# EAGLE schematic MD (EAGLE 9.6.2)
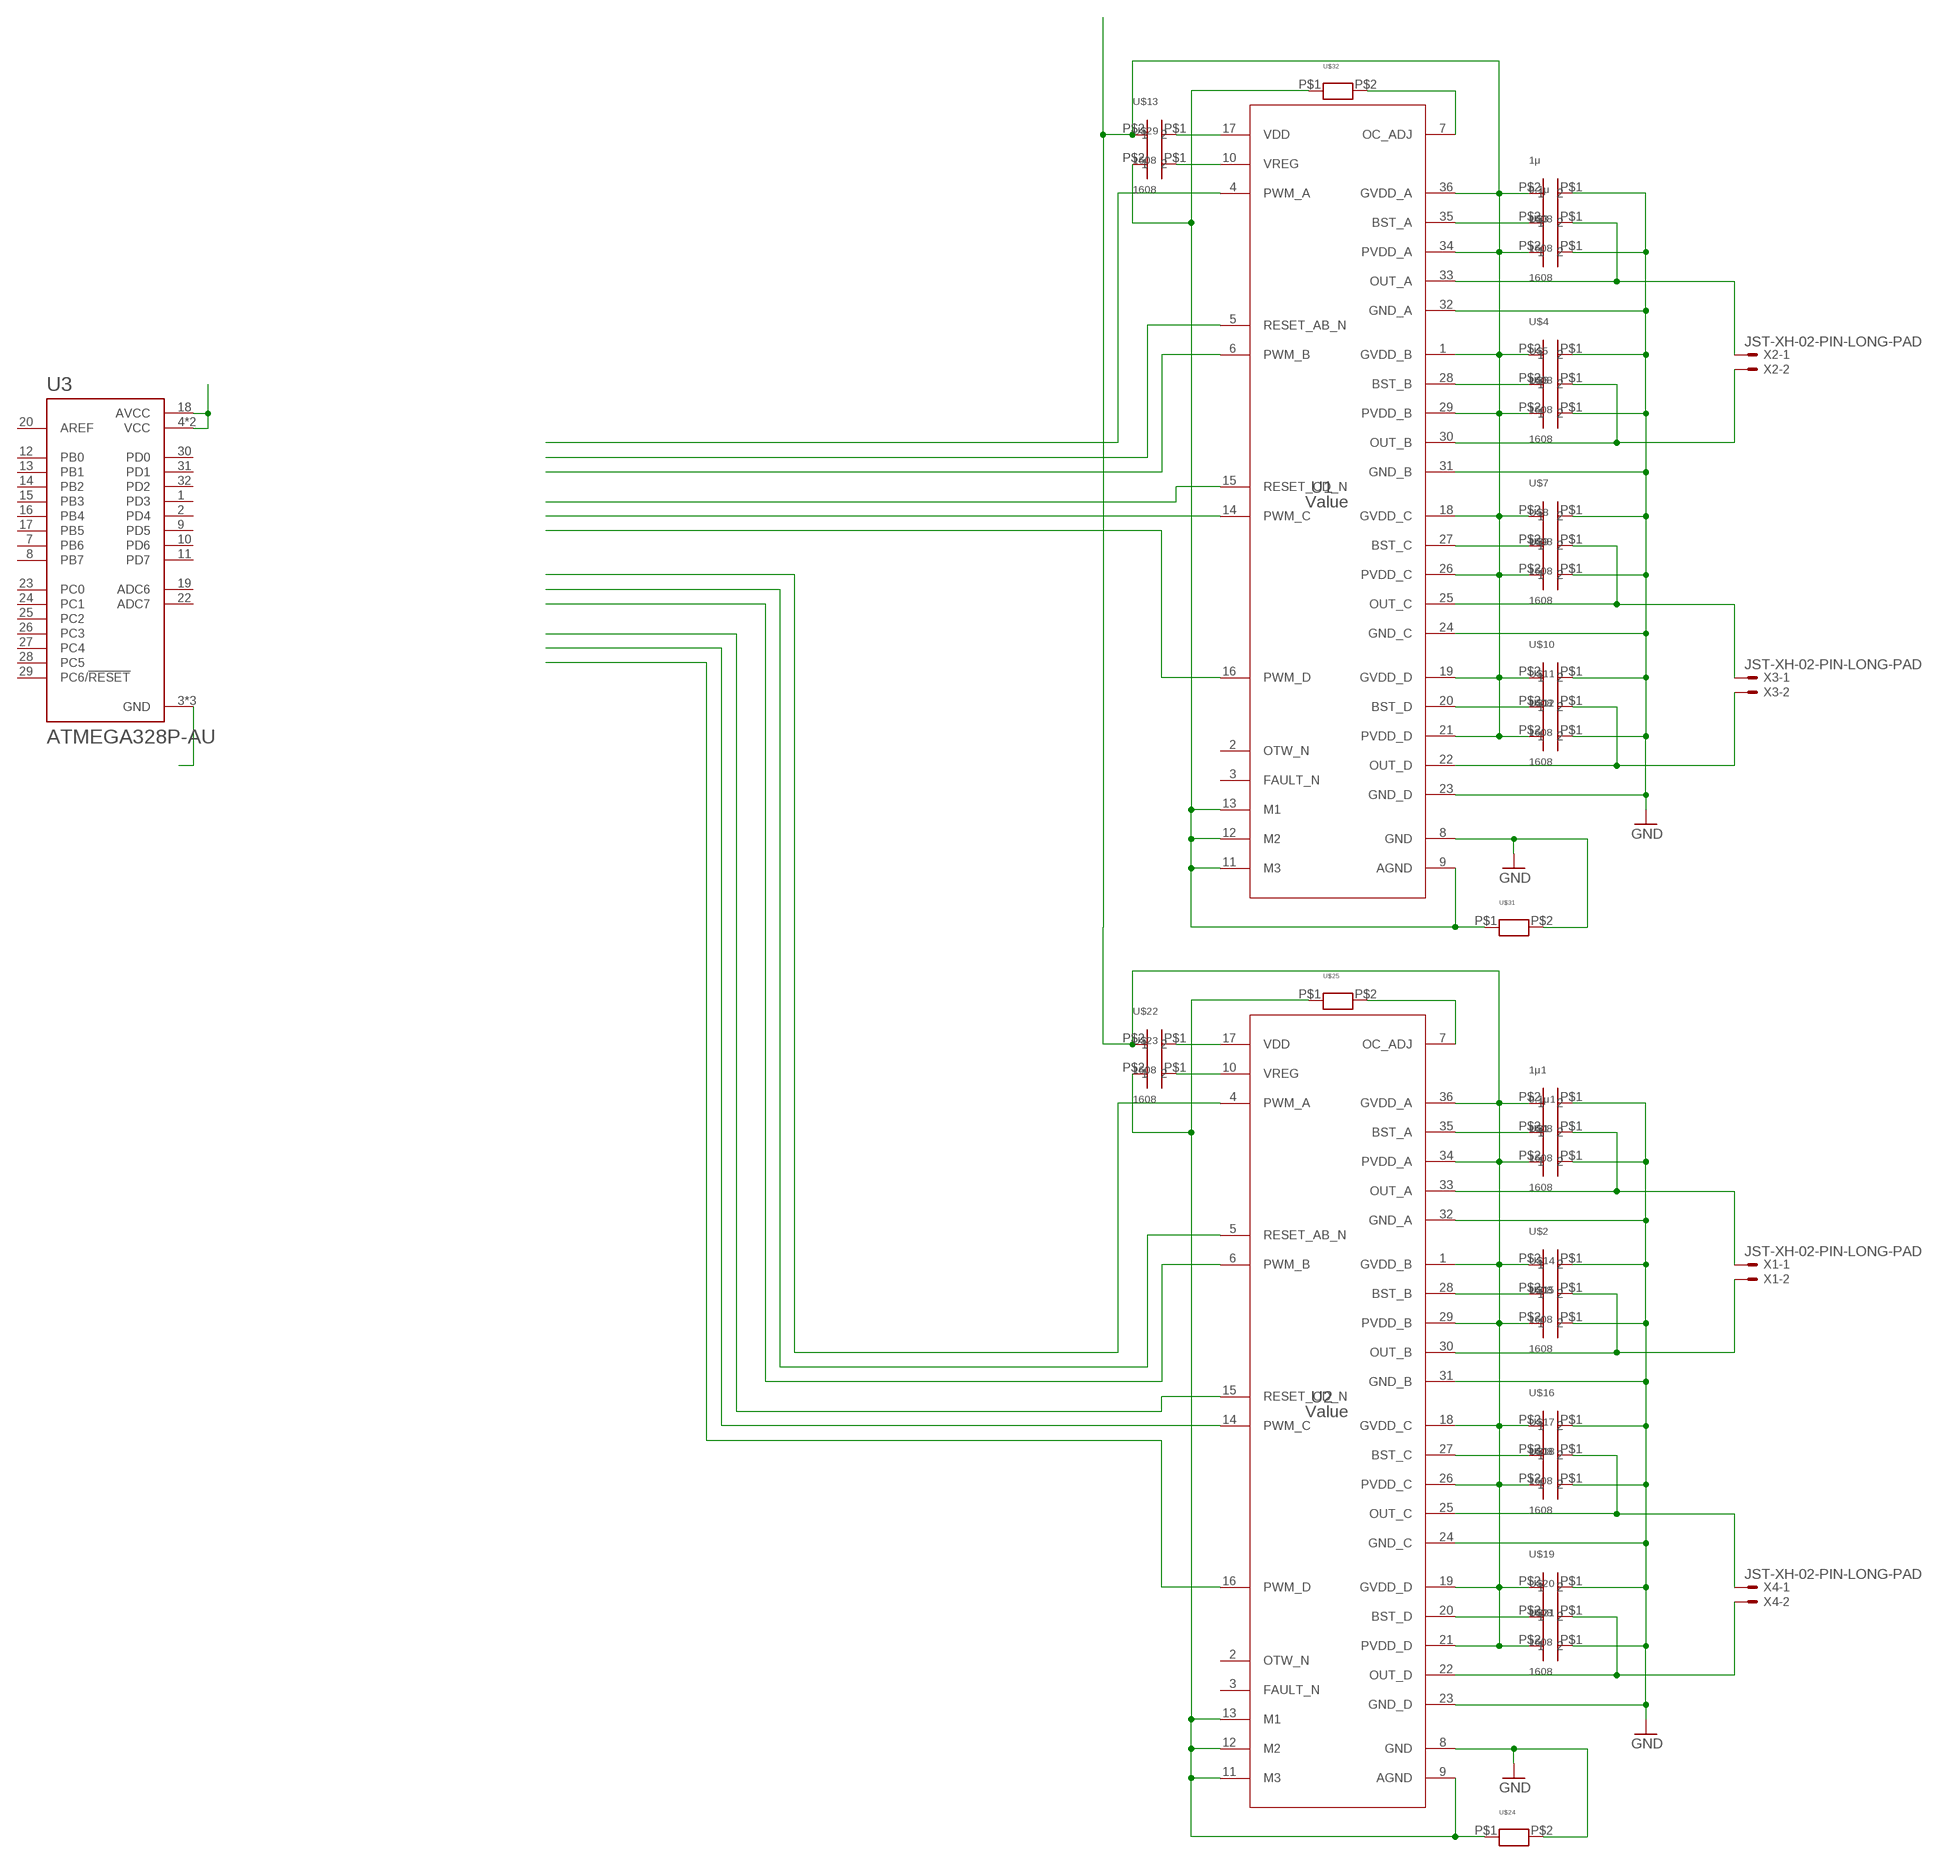
[diagram p0: schematic, sheet 1]

## Parts
0.1μ  1608  [CON]
0.1μ1  1608  [CON]
1μ  1608  [CON]
1μ1  1608  [CON]
U1  Value  DRV8432DKDR  [DKD0036A]
U2  Value  DRV8432DKDR  [DKD0036A]
U3  ATMEGA328P-AU  [QFP80P900X900X120-32N]
U$1  1608  [CON]
U$2  1608  [CON]
U$3  1608  [CON]
U$4  1608  [CON]
U$5  1608  [CON]
U$6  1608  [CON]
U$7  1608  [CON]
U$8  1608  [CON]
U$9  1608  [CON]
U$10  1608  [CON]
U$11  1608  [CON]
U$12  1608  [CON]
U$13  1608  [CON]
U$14  1608  [CON]
U$15  1608  [CON]
U$16  1608  [CON]
U$17  1608  [CON]
U$18  1608  [CON]
U$19  1608  [CON]
U$20  1608  [CON]
U$21  1608  [CON]
U$22  1608  [CON]
U$23  1608  [CON]
U$24  R  [1608]
U$25  R  [1608]
U$29  1608  [CON]
U$31  R  [1608]
U$32  R  [1608]
X1  JST-XH-02-PIN-LONG-PAD  [JST-XH-02-PACKAGE-LONG-PAD]
X2  JST-XH-02-PIN-LONG-PAD  [JST-XH-02-PACKAGE-LONG-PAD]
X3  JST-XH-02-PIN-LONG-PAD  [JST-XH-02-PACKAGE-LONG-PAD]
X4  JST-XH-02-PIN-LONG-PAD  [JST-XH-02-PACKAGE-LONG-PAD]

## Nets
GND: 1μ1.P$1 1μ.P$1 U1.8(GND) U1.23(GND_D) U1.24(GND_C) U1.31(GND_B) U1.32(GND_A) U2.8(GND) U2.23(GND_D) U2.24(GND_C) U2.31(GND_B) U2.32(GND_A) U$1.P$1 U$2.P$1 U$3.P$1 U$4.P$1 U$6.P$1 U$7.P$1 U$9.P$1 U$10.P$1 U$12.P$1 U$15.P$1 U$16.P$1 U$18.P$1 U$19.P$1 U$21.P$1 U$24.P$2 U$31.P$2
N$1: U1.20(BST_D) U$11.P$2
N$2: U1.27(BST_C) U$8.P$2
N$3: U1.28(BST_B) U$5.P$2
N$4: U1.15(RESET_CD_N)
N$5: 0.1μ.P$2 U1.35(BST_A)
N$6: 0.1μ.P$1 U1.33(OUT_A) X2.1
N$7: U1.30(OUT_B) U$5.P$1 X2.2
N$8: U1.25(OUT_C) U$8.P$1 X3.1
N$9: U1.22(OUT_D) U$11.P$1 X3.2
N$10: U1.17(VDD) U$13.P$1
N$11: U1.10(VREG) U$29.P$1
N$12: U1.6(PWM_B)
N$13: U1.14(PWM_C)
N$14: U1.9(AGND) U1.11(M3) U1.12(M2) U1.13(M1) U$29.P$2 U$31.P$1 U$32.P$1
N$15: U1.5(RESET_AB_N)
N$16: U1.4(PWM_A)
N$17: U1.7(OC_ADJ) U$32.P$2
N$18: U1.16(PWM_D)
N$22: U2.20(BST_D) U$20.P$2
N$23: U2.27(BST_C) U$17.P$2
N$24: U2.28(BST_B) U$14.P$2
N$25: 1μ1.P$2 1μ.P$2 U1.1(GVDD_B) U1.18(GVDD_C) U1.19(GVDD_D) U1.21(PVDD_D) U1.26(PVDD_C) U1.29(PVDD_B) U1.34(PVDD_A) U1.36(GVDD_A) U2.1(GVDD_B) U2.18(GVDD_C) U2.19(GVDD_D) U2.21(PVDD_D) U2.26(PVDD_C) U2.29(PVDD_B) U2.34(PVDD_A) U2.36(GVDD_A) U$1.P$2 U$2.P$2 U$3.P$2 U$4.P$2 U$6.P$2 U$7.P$2 U$9.P$2 U$10.P$2 U$12.P$2 U$13.P$2 U$15.P$2 U$16.P$2 U$18.P$2 U$19.P$2 U$21.P$2 U$22.P$2
N$26: 0.1μ1.P$2 U2.35(BST_A)
N$27: 0.1μ1.P$1 U2.33(OUT_A) X1.1
N$28: U2.30(OUT_B) U$14.P$1 X1.2
N$29: U2.25(OUT_C) U$17.P$1 X4.1
N$30: U2.22(OUT_D) U$20.P$1 X4.2
N$31: U2.17(VDD) U$22.P$1
N$32: U2.10(VREG) U$23.P$1
N$33: U2.14(PWM_C)
N$34: U2.9(AGND) U2.11(M3) U2.12(M2) U2.13(M1) U$23.P$2 U$24.P$1 U$25.P$1
N$35: U2.7(OC_ADJ) U$25.P$2
N$36: U2.15(RESET_CD_N)
N$37: U2.6(PWM_B)
N$38: U2.5(RESET_AB_N)
N$39: U2.4(PWM_A)
N$40: U2.16(PWM_D)
N$43: U3.4(VCC) U3.6(VCC) U3.18(AVCC)
N$44: U3.3(GND) U3.5(GND) U3.21(GND)
Unconnected: U1.2(OTW_N) U1.3(FAULT_N) U2.2(OTW_N) U2.3(FAULT_N) U3.1(PD3) U3.2(PD4) U3.7(PB6) U3.8(PB7) U3.9(PD5) U3.10(PD6) U3.11(PD7) U3.12(PB0) U3.13(PB1) U3.14(PB2) U3.15(PB3) U3.16(PB4) U3.17(PB5) U3.19(ADC6) U3.20(AREF) U3.22(ADC7) U3.23(PC0) U3.24(PC1) U3.25(PC2) U3.26(PC3) U3.27(PC4) U3.28(PC5) U3.29(PC6/!RESET) U3.30(PD0) U3.31(PD1) U3.32(PD2)

## Library data of the parts
0.1μ 0.1μ1 1μ 1μ1 U$1-U$23 U$29 = con1608:1608
U1 U2 = drv84321:DRV8432DKDR; ALTERNATEPARTNUMBER: DRV8432DKD; APPLICATION_BUILDNUMBER: *; COMPTYPE: IC; MANUFACTURER: Texas Instruments; MOUNTTYPE: SMT; PACKAGEREFERENCE: DKD0036A; PARTNUMBER: DRV8432DKDR; PIN_COUNT: 36; REFDES: RefDes; ROHS: Y; TYPE: TYPE
U3 = ATMEGA328P-AU:ATMEGA328P-AU: ATmega Series 20 MHz 32 KB Flash 2 KB SRAM 8-Bit Microcontroller - TQFP-32 Check prices <https://pricing.snapeda.com/parts/ATMEGA328P-AU/Microchip%20Technology/view-part?ref=eda>; AVAILABILITY: In Stock; DESCRIPTION: AVR AVR® ATmega Microcontroller IC 8-Bit 20MHz 32KB (16K x 16) FLASH 32-TQFP (7x7); MF: Microchip Technology; MP: ATMEGA328P-AU; PACKAGE: TQFP-32 Microchip; PRICE: None
U$24 U$25 U$31 U$32 = R 1608:R
X1-X4 = Rembrandt Electronics - JST XH Connectors v1-0:JST-XH-02-PIN: JST XH Connector 2 Pin Wire to board connector. Pitch: 2,54 mm, (0.100") Number of pins: 2 Created by Rembrandt Electronics www.rembrandtelectronics.com